# EAGLE design breakout (EAGLE 9.2.0)
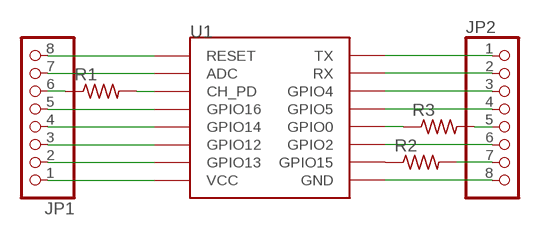
[diagram p0: schematic, sheet 1]

## Parts
JP1  PINHD-1X8_2.54  [1X08]
JP2  PINHD-1X8_2.54  [1X08]
R1  R-US_R0805  [R0805]
R2  R-US_R0805  [R0805]
R3  R-US_R0805  [R0805]
U1  ESP12SMD  [ESP12-SMD]

## Nets
N$1: JP1.1 U1.VCC
N$2: JP1.2 U1.GPIO13
N$3: JP1.3 U1.GPIO12
N$4: JP1.4 U1.GPIO14
N$5: JP1.5 U1.GPIO16
N$7: JP1.7 U1.ADC
N$8: JP1.8 U1.RESET
N$9: JP2.1 U1.TXD0(TX)
N$10: JP2.2 U1.RXD0(RX)
N$11: JP2.3 U1.GPIO4
N$12: JP2.4 U1.GPIO5
N$13: R3.1 U1.GPIO0
N$14: JP2.6 U1.GPIO2
N$15: JP1.6 R1.1
N$16: JP2.8 U1.GND
N$17: R1.2 U1.CH_PD
N$18: R2.1 U1.GPIO15
N$19: JP2.5 R3.2
N$20: JP2.7 R2.2

## Library data of the parts
JP1 JP2 = pinhead-1:PINHD-1X8: PIN HEADER
R1-R3 = resistor:R-US_: RESISTOR, American symbol
U1 = esp8266modules:ESP12: ESP8266 Wifi module 12

## Board
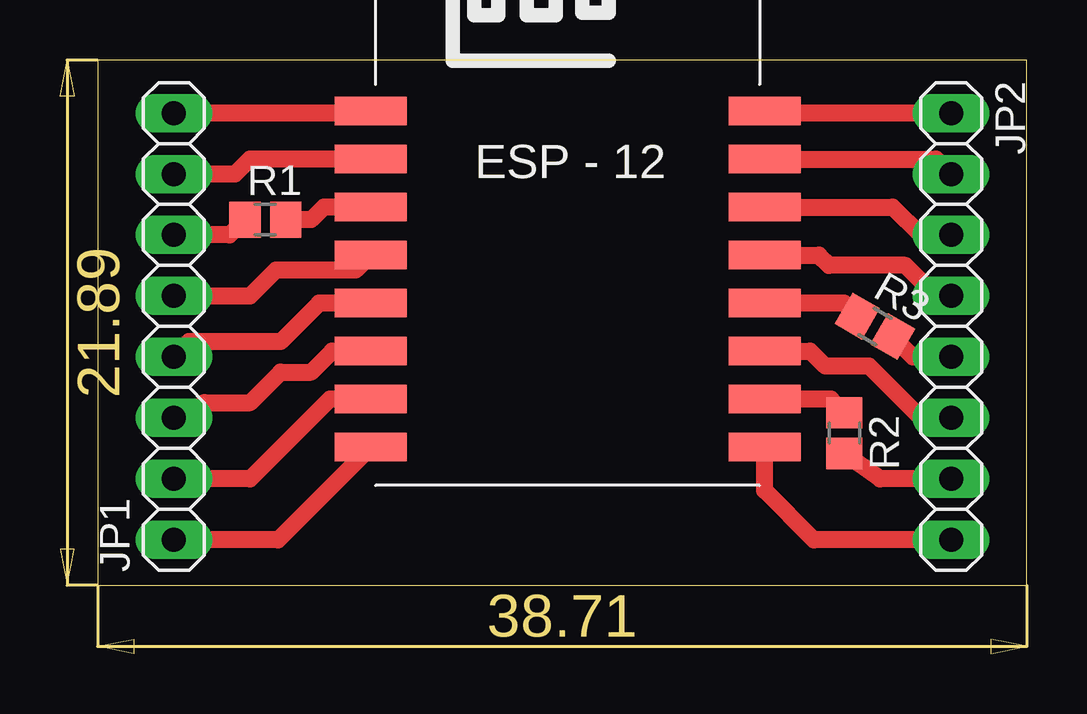
[diagram p1: board, top side]

Size 38.71 x 21.89 mm. Coordinates in mm from the lower left corner, seen from the top.
Outline: 0,0 38.71,0 38.71,21.89 0,21.89 0,0
Copper layers (1*16): Top 0.035mm / dielectric 1.5mm / Bottom 0.035mm
Design rules "default *": minimum track width 18mil, minimum drill 0.8mm, track to track 6mil, track to pad 6mil, pad to pad 6mil, via to via 6mil, smd to smd 6mil, copper to edge 40mil, drill to drill 31mil, minimum pad ring 10mil, minimum via ring 8mil, stop-mask expansion 4mil, vias tented up to drill 0mil, thermal gap 10mil

### Footprints (pad centres in the part's own frame; a part is rotated, then mirrored left to right if it is on the bottom)
1X08 = drill 1 pad 1.6 long: 1 -8.89,0; 2 -6.35,0; 3 -3.81,0; 4 -1.27,0; 5 1.27,0; 6 3.81,0; 7 6.35,0; 8 8.89,0
R0805 = smd 1.3 x 1.5: 1 -0.85,0; 2 0.85,0
ESP12-SMD = smd 3 x 1.2: ADC -8.3,3.8; CH_PD -8.3,1.8; GND 8.1,-8.2; GPIO0 8.1,-2.2; GPIO2 8.1,-4.2; GPIO4 8.1,1.8; GPIO5 8.1,-0.2; GPIO12 -8.3,-4.2; GPIO13 -8.3,-6.2; GPIO14 -8.3,-2.2; GPIO15 8.1,-6.2; GPIO16 -8.3,-0.2; RESET -8.3,5.8; RXD0 8.1,3.8; TXD0 8.1,5.8; VCC -8.3,-8.2

### Placement (x,y rotation side)
JP1  3.17,10.79 90 top
JP2  35.56,10.79 270 top
R1  6.98,15.24 0 top
R2  31.12,6.35 270 top
R3  32.38,10.79 330 top
U1  19.69,13.97 0 top

### Tracks (layer width: path | path; a pad name or v marks a point on that pad's centre or on a via)
N$1
  Top 0.7: U1.VCC 7.52,1.91 JP1.1
N$2
  Top 0.7: JP1.2 6.35,4.44 9.67,7.77 U1.GPIO13
N$3
  Top 0.7: JP1.3 3.81,6.99 4.45,7.62 6.35,7.62 7.62,8.89 8.89,8.89 9.77,9.77 U1.GPIO12
N$4
  Top 0.7: JP1.4 3.81,10.16 7.62,10.16 9.23,11.77 U1.GPIO14
N$5
  Top 0.7: JP1.5 6.35,12.07 7.42,13.13 10.75,13.13 U1.GPIO16
N$7
  Top 0.7: JP1.7 5.71,17.14 6.34,17.77 U1.ADC
N$8
  Top 0.7: U1.RESET 11.3,19.68 JP1.8
N$9
  Top 0.7: 36.2,19.68 JP2.1 27.87,19.68 U1.TXD0
N$10
  Top 0.7: U1.RXD0 34.93,17.77 JP2.2
N$11
  Top 0.7: U1.GPIO4 33.12,15.77 34.29,14.61 JP2.3
N$12
  Top 0.7: U1.GPIO5 30.05,13.77 30.48,13.34 33.66,13.34 34.92,12.07 JP2.4
N$13
  Top 0.7: R3.1 31.1,11.77 U1.GPIO0
N$14
  Top 0.7: U1.GPIO2 29.69,9.77 30.33,9.13 32.14,9.13 34.29,6.99 JP2.6
N$15
  Top 0.7: JP1.6 5.5,14.61 R1.1
N$16
  Top 0.7: JP2.8 29.85,1.91 27.79,3.96 27.79,5.08 | 27.79,5.08 U1.GND | 27.79,5.08
N$17
  Top 0.7: R1.2 8.89,15.24 9.42,15.77 U1.CH_PD
N$18
  Top 0.7: R2.1 30.55,7.77 U1.GPIO15
N$19
  Top 0.7: R3.2 33.97,9.53 JP2.5
N$20
  Top 0.7: R2.2 32.6,4.44 JP2.7